# Altium schematic sheet Mesures.SchDoc: MESURES CAPTEUR TEMPÉRATURE
size A4; DrawnBy: ALBOUY Thomas; DocumentNumber: 3/6; Revision: V5.0 REV.A; SheetNumber: 3; SheetTotal: 6
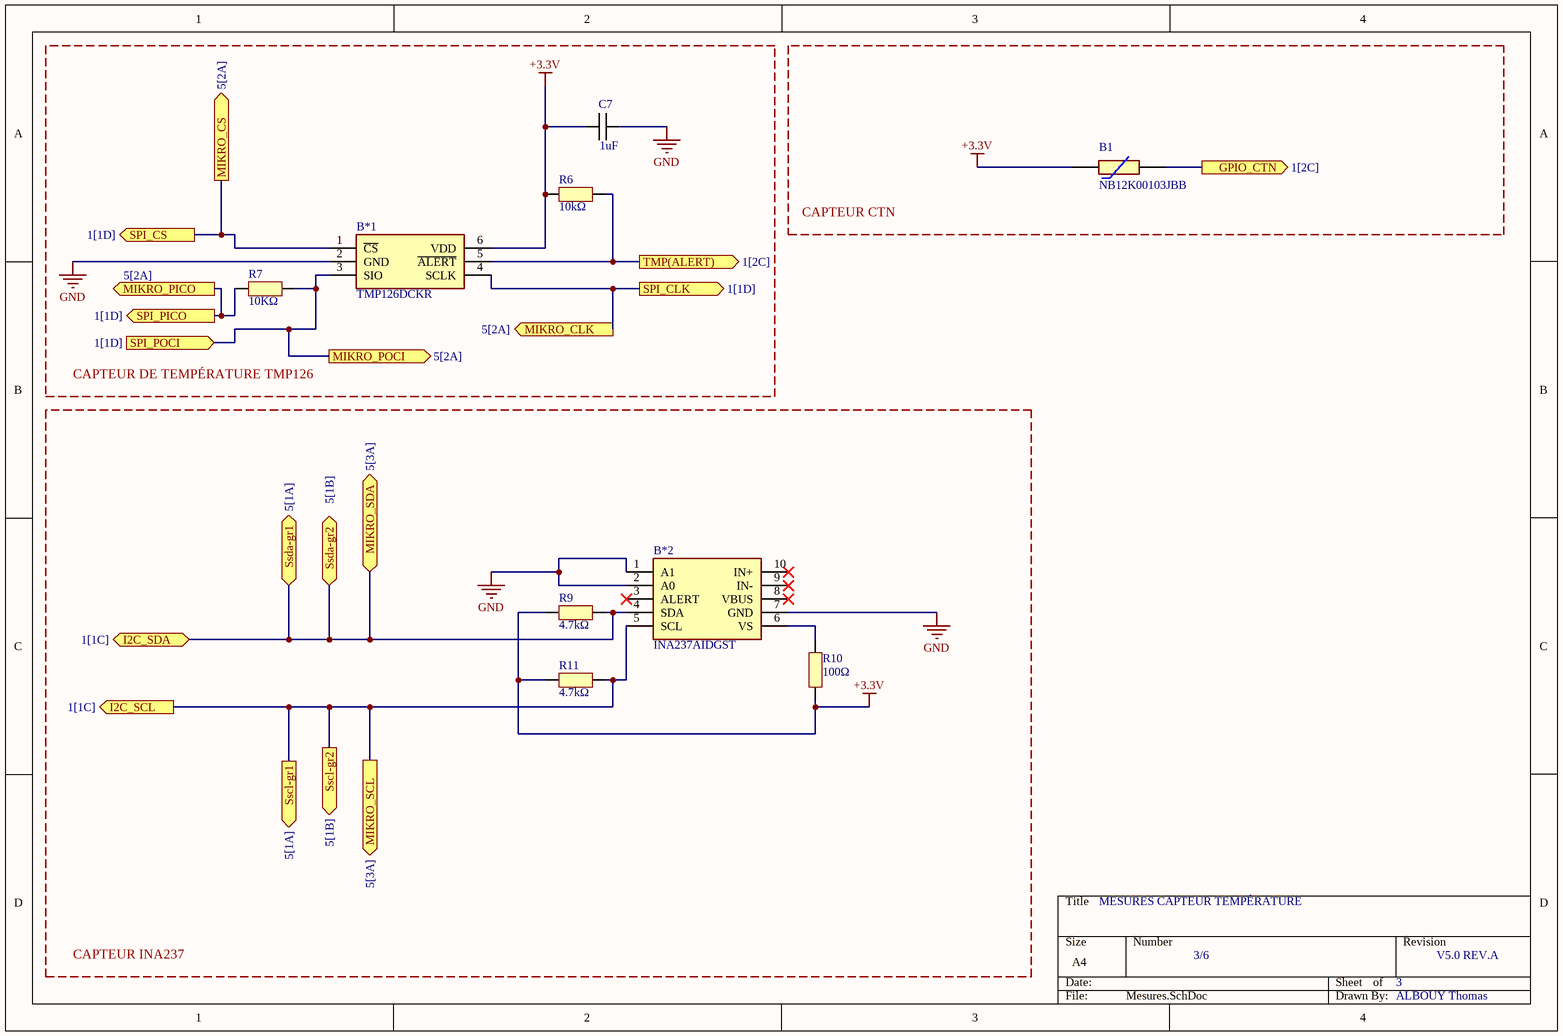
[diagram p0: Mesures.SchDoc]

## Parts
B1  NB12K00103JBB  [RESC2212X50N]
B*1  TMP126DCKR  [SOT65P210X110-6N]
B*2  INA237AIDGST  [SOP50P490X110-10N]
C7  1uF  [CAPC1005X06N]
R6  10kΩ  [RESC1005X06N]
R7  10KΩ  [RESC1005X06N]
R9  4.7kΩ  [RESC1005X06N]
R10  100Ω  [RESC1005X06N]
R11  4.7kΩ  [RESC1005X06N]

## Blocks framed on the sheet
CAPTEUR DE TEMPÉRATURE TMP126: B*1 C7 R6 R7
CAPTEUR CTN: B1
CAPTEUR INA237: B*2 R9-R11

## Ports
GPIO_CTN (out, see 1[2C]), I2C_SCL (out, see 1[1C]), I2C_SDA (bidir, see 1[1C]), MIKRO_CLK (out, see 5[2A]), MIKRO_CS (out, see 5[2A]), MIKRO_PICO (out, see 5[2A]), MIKRO_POCI (out, see 5[2A]), MIKRO_SCL (out, see 5[3A]), MIKRO_SDA (bidir, see 5[3A]), SPI_CLK (out, see 1[1D]), SPI_CS (out, see 1[1D]), SPI_PICO (out, see 1[1D]), SPI_POCI (in, see 1[1D]), Sscl-gr1 (out, see 5[1A]), Sscl-gr2 (out, see 5[1B]), Ssda-gr1 (bidir, see 5[1A]), Ssda-gr2 (bidir, see 5[1B]), TMP(ALERT) (out, see 1[2C])

## Nets
+3.3V: B1.1 B*1.6(VDD) C7.1 R6.1 R9.1 R10.1 R11.1
GND: B*1.2(GND) B*2.1(A1) B*2.2(A0) B*2.7(GND) C7.2
GPIO_CTN: B1.2 ; port GPIO_CTN
I2C_SCL: B*2.5(SCL) R11.2 ; port I2C_SCL, port Sscl-gr1, port Sscl-gr2, port MIKRO_SCL
I2C_SDA: B*2.4(SDA) R9.2 ; port I2C_SDA, port Ssda-gr1, port Ssda-gr2, port MIKRO_SDA
MIKRO_CLK: B*1.4(SCLK) ; port SPI_CLK, port MIKRO_CLK
MIKRO_CS: B*1.1(~{CS}) ; port SPI_CS, port MIKRO_CS
MIKRO_PICO: R7.1 ; port SPI_PICO, port MIKRO_PICO
MIKRO_POCI: B*1.3(SIO) R7.2 ; port SPI_POCI, port MIKRO_POCI
TMP(ALERT): B*1.5(~{ALERT}) R6.2 ; port TMP(ALERT)
NetB*2_6: B*2.6(VS) R10.2

Not connected (* = marked no-connect by the designer): B*2 3(ALERT)* 8(VBUS)* 9(IN-)* 10(IN+)*

## Notes on the sheet
- 3

## Library data of the parts
B1 = NB12K00103JBB: NTC SMD Thermistor, NB12K, 10K, 5% AVX 10k 0805 Protection NTC Thermistor, 5s, 2 x 1.25 x 1.3mm; Manufacturer_Name: Kyocera AVX; Geometry.Height: 0.5mm; Manufacturer_Part_Number: NB12K00103JBB; Mouser Part Number: 581-NB12K00103JBB; Mouser Price/Stock: https://www.mouser.co.uk/ProductDetail/AVX/NB12K00103JBB/?qs=4%252B6%252BTdINQeDPvI%252BQUQjJ3Q%3D%3D; Arrow Part Number: NB12K00103JBB; Arrow Price/Stock: https://www.arrow.com/en/products/nb12k00103jbb/avx; Datasheet Link: https://datasheet.datasheetarchive.com/originals/distributors/Datasheets-DGA6/551314.pdf
B*1 = TMP126DCKR: Board Mount Temperature Sensors +/-0.25 C SPI temperature sensor with 175 C operation, CRC and slew-rate alert; Manufacturer_Name: Texas Instruments; Manufacturer_Part_Number: TMP126DCKR; Mouser Part Number: 595-TMP126DCKR
B*2 = INA237AIDGST: Current Sense Amplifiers 85-V, 16-bit, I2C output current/voltage/power monitor with alert 10-VSSOP -40 to 125; Manufacturer_Name: Texas Instruments; Manufacturer_Part_Number: INA237AIDGST; Mouser Part Number: 595-INA237AIDGST
C7 = Capacitor
R6 R7 R9-R11 = Resistor